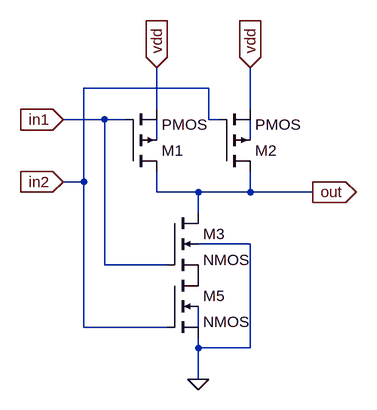
[diagram p0: schematic nand.asc]
nand.asc, the LTspice schematic file:
Version 4
SHEET 1 880 680
WIRE 16 -208 -176 -208
WIRE -64 -176 -64 -240
WIRE 80 -176 80 -240
WIRE -144 -160 -208 -160
WIRE -112 -160 -144 -160
WIRE 16 -160 16 -208
WIRE 32 -160 16 -160
WIRE -64 -128 -64 -160
WIRE 80 -128 80 -160
WIRE -176 -64 -176 -208
WIRE -176 -64 -208 -64
WIRE -64 -48 -64 -80
WIRE 0 -48 -64 -48
WIRE 80 -48 80 -80
WIRE 80 -48 0 -48
WIRE 176 -48 80 -48
WIRE 0 -16 0 -48
WIRE 80 32 0 32
WIRE -144 64 -144 -160
WIRE -48 64 -144 64
WIRE -176 160 -176 -64
WIRE -48 160 -176 160
WIRE 0 160 0 128
WIRE 0 192 0 176
WIRE 80 192 80 32
WIRE 80 192 0 192
WIRE 0 240 0 192
FLAG -208 -160 in1
IOPIN -208 -160 In
FLAG -208 -64 in2
IOPIN -208 -64 In
FLAG 176 -48 out
IOPIN 176 -48 Out
FLAG 80 -240 vdd
IOPIN 80 -240 In
FLAG -64 -240 vdd
IOPIN -64 -240 In
FLAG 0 240 0
SYMBOL pmos4 -112 -80 M180
SYMATTR InstName M1
SYMATTR Value2 l=90n w=400n
SYMBOL pmos4 32 -80 M180
SYMATTR InstName M2
SYMATTR Value2 l=90n w=400n
SYMBOL nmos4 -48 -16 R0
SYMATTR InstName M3
SYMATTR Value2 l=90n w=200n
SYMBOL nmos4 -48 80 R0
SYMATTR InstName M5
SYMATTR Value2 l=90n w=200n

The netlist it stands for:
* nand.asc
M1 out in1 vdd N001 PMOS l=90n w=400n
M2 out in2 vdd N002 PMOS l=90n w=400n
M3 out in1 P001 0 NMOS l=90n w=200n
M5 P001 in2 0 N003 NMOS l=90n w=200n
.model NMOS NMOS
.model PMOS PMOS
.lib standard.mos
.backanno
.end